# Altium schematic sheet 电源管理板Qiao.SchDoc
size A3
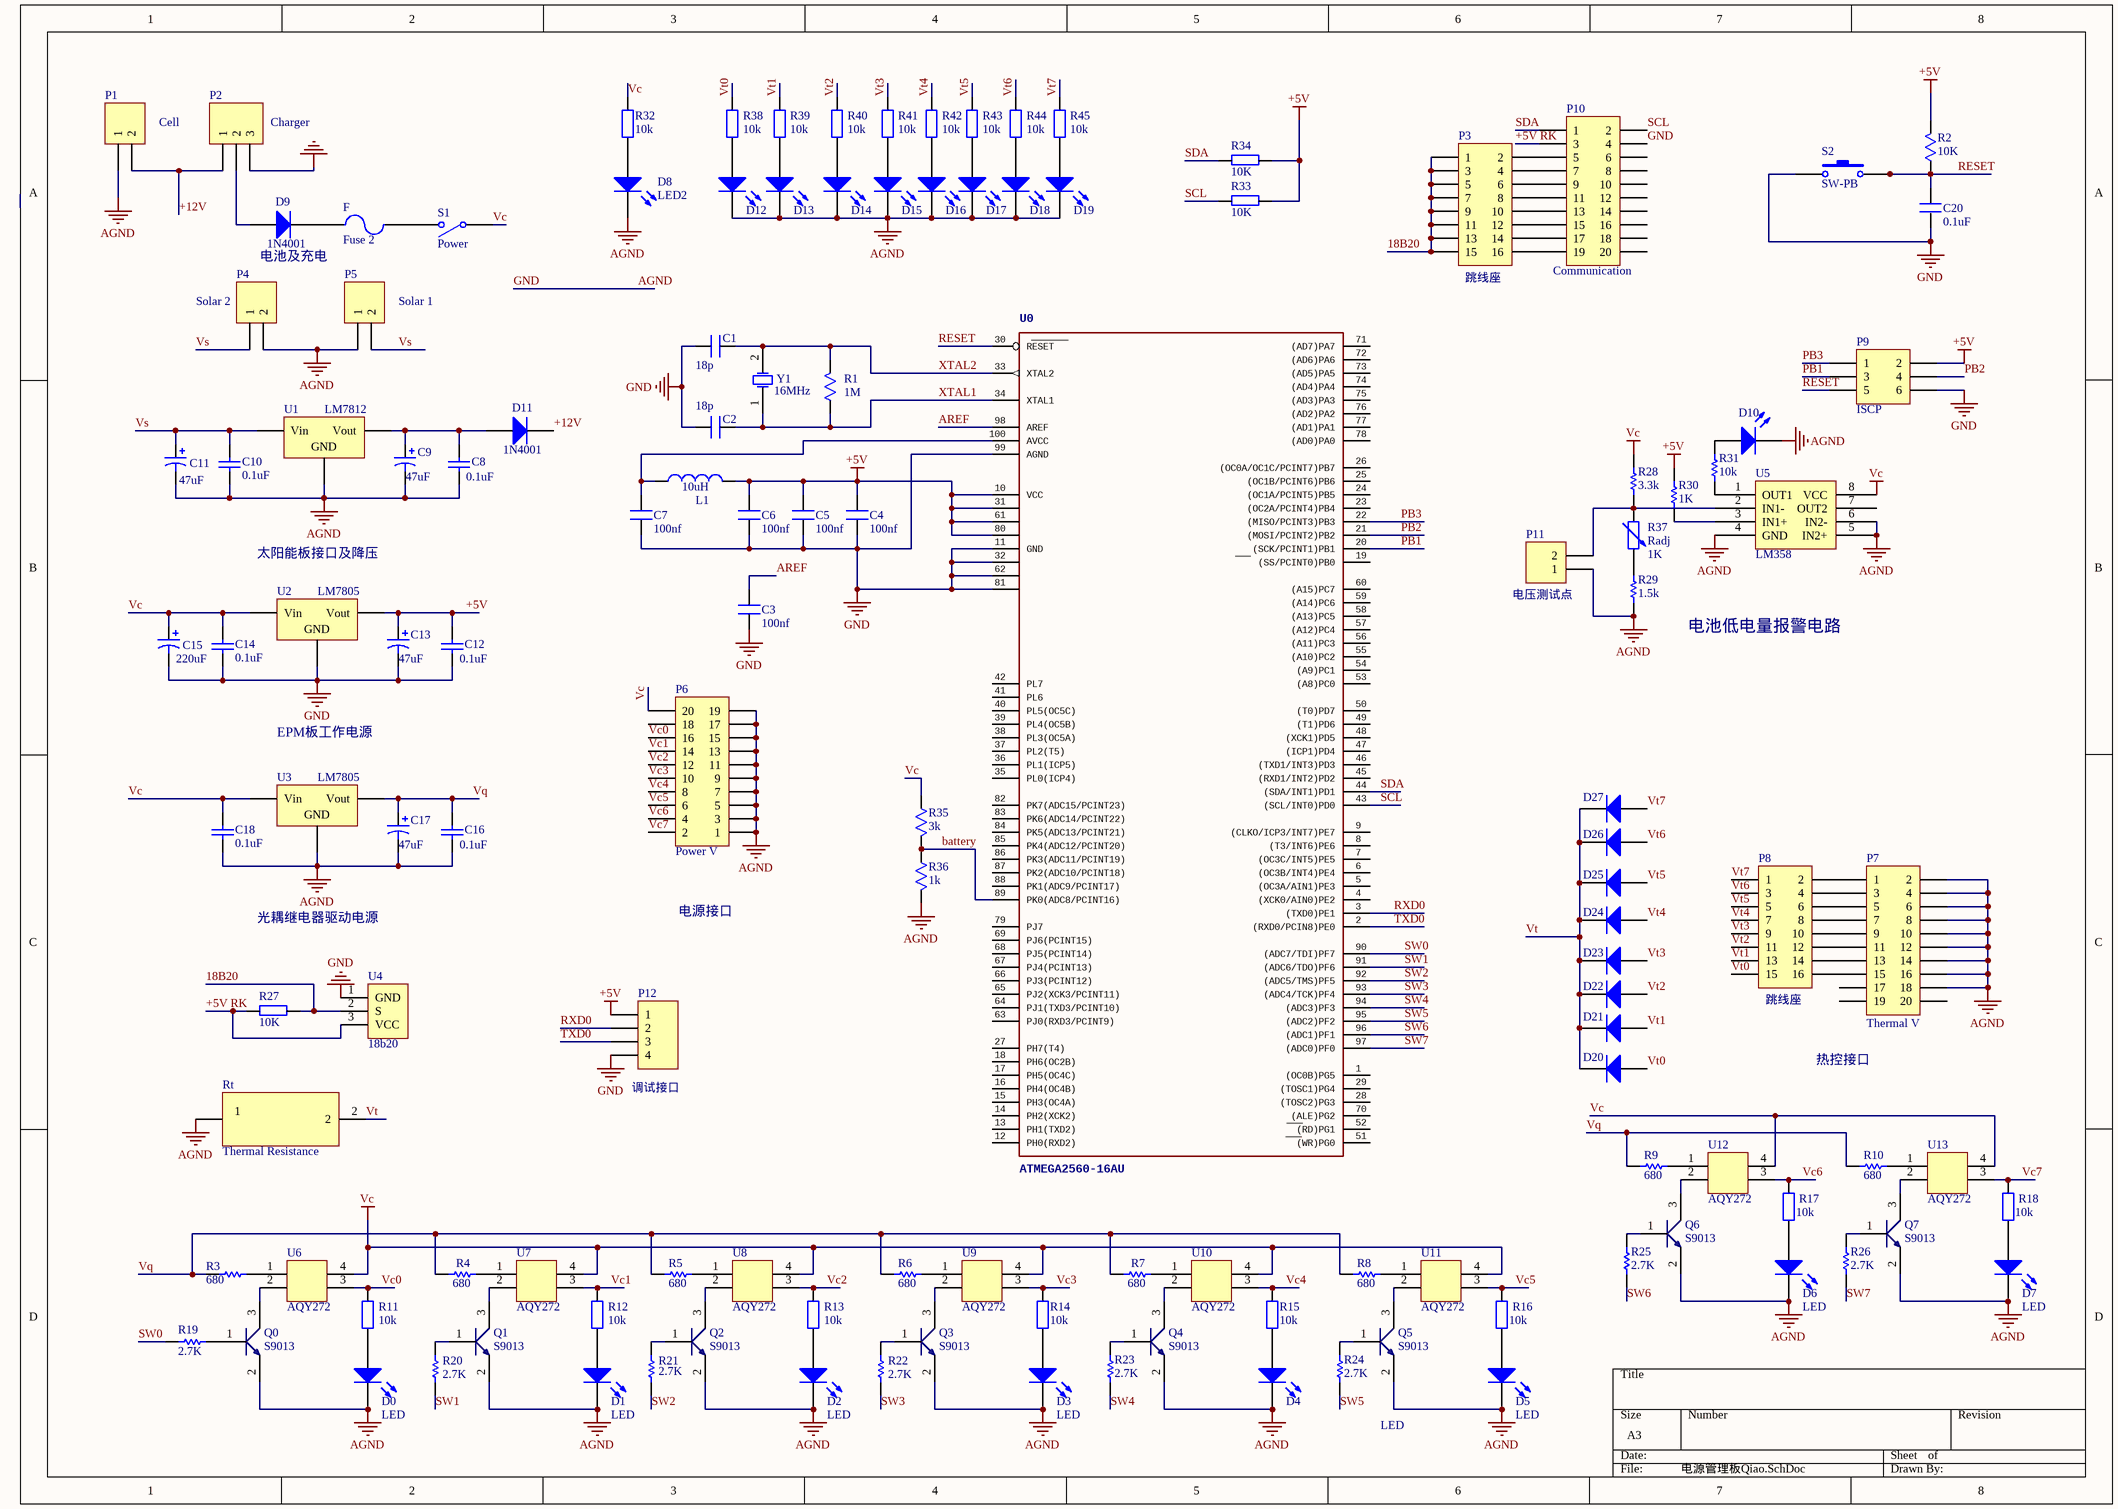
[diagram p0: 电源管理板Qiao.SchDoc]

## Parts
C1  18p  [CAPC3216M]
C2  18p  [CAPC3216M]
C3  100nf  [CAPC3216M]
C4  100nf  [CAPC3216M]
C5  100nf  [CAPC3216M]
C6  100nf  [CAPC3216M]
C7  100nf  [CAPC3216M]
C8  0.1uf  [CAPC3216M]
C9  value 47uF  [25V47uF]  (hidden comment: 25V47uF)
C10  0.1uf  [CAPC3216M]
C11  value 47uF  [25V47uF]  (hidden comment: 25V47uF)
C12  0.1uf  [CAPC3216M]
C13  value 47uF  [25V47uF]  (hidden comment: 25V47uF)
C14  0.1uf  [CAPC3216M]
C15  value 220uF  [25V47uF]  (hidden comment: 50V220uF)
C16  0.1uf  [CAPC3216M]
C17  value 47uF  [25V47uF]  (hidden comment: 25V47uF)
C18  0.1uf  [CAPC3216M]
C20  0.1uF  [CAPC3216M]
D0  LED  [LED]
D1  LED  [LED]
D2  LED  [LED]
D3  LED  [LED]
D4  LED  [LED]
D5  LED  [LED]
D6  LED  [LED]
D7  LED  [LED]
D8  LED2  [DIPLED]
D9  1N4001  [SMB]
D10  LED  [DIPLED]  (value not drawn)
D11  1N4001  [SMB]
D12  LED  [LED]  (value not drawn)
D13  LED  [LED]  (value not drawn)
D14  LED  [LED]  (value not drawn)
D15  LED  [LED]  (value not drawn)
D16  LED  [LED]  (value not drawn)
D17  LED  [LED]  (value not drawn)
D18  LED  [LED]  (value not drawn)
D19  LED  [LED]  (value not drawn)
D20  1N4001  [SMB]  (value not drawn)
D21  1N4001  [SMB]  (value not drawn)
D22  1N4001  [SMB]  (value not drawn)
D23  1N4001  [SMB]  (value not drawn)
D24  1N4001  [SMB]  (value not drawn)
D25  1N4001  [SMB]  (value not drawn)
D26  1N4001  [SMB]  (value not drawn)
D27  1N4001  [SMB]  (value not drawn)
F  Fuse 2  [1812]
L1  value 10uH  [CAPC3216M]  (hidden comment: Inductor)
P1  Cell  [2P3.96wanzhenzuo]
P2  Charger  [ChargeSocket]
P3  跳线座  [HDR2X8]
P4  Solar 2  [2P3.96wanzhenzuo]
P5  Solar 1  [2P3.96wanzhenzuo]
P6  Power V  [HDR2X10]
P7  Thermal V  [HDR2X10]
P8  跳线座  [HDR2X8]
P9  ISCP  [HDR2X3]
P10  Communication  [HDR2X10]
P11  电压测试点  [HDR1X2]
P12  调试接口  [HDR1X4]
Q0  S9013  [SOT23]
Q1  S9013  [sot23]
Q2  S9013  [sot23]
Q3  S9013  [sot23]
Q4  S9013  [sot23]
Q5  S9013  [sot23]
Q6  S9013  [sot23]
Q7  S9013  [sot23]
R1  1M  [RESC3216M]
R2  10K  [RESC3216M]
R3  680  [RESC3216M]
R4  680  [RESC3216M]
R5  680  [RESC3216M]
R6  680  [RESC3216M]
R7  680  [RESC3216M]
R8  680  [RESC3216M]
R9  680  [RESC3216M]
R10  680  [RESC3216M]
R11  10K  [RESC3216M]
R12  10K  [RESC3216M]
R13  10K  [RESC3216M]
R14  10K  [RESC3216M]
R15  10K  [RESC3216M]
R16  10K  [RESC3216M]
R17  10K  [RESC3216M]
R18  10K  [RESC3216M]
R19  2.7K  [RESC3216M]
R20  2.7K  [RESC3216M]
R21  2.7K  [RESC3216M]
R22  2.7K  [RESC3216M]
R23  2.7K  [RESC3216M]
R24  2.7K  [RESC3216M]
R25  2.7K  [RESC3216M]
R26  2.7K  [RESC3216M]
R27  10K  [RESC3216M]
R28  3.3k  [CAPC3216M]
R29  1.5k  [CAPC3216M]
R30  1K  [CAPC3216M]
R31  10k  [CAPC3216M]
R32  10k  [RESC3216M]
R33  10K  [RESC3216M]
R34  10K  [RESC3216M]
R35  3k  [RESC3216M]
R36  1k  [RESC3216M]
R37  Radj  value 1K  [ResAdj]
R38  10K  [RESC3216M]
R39  10K  [RESC3216M]
R40  10K  [RESC3216M]
R41  10K  [RESC3216M]
R42  10K  [RESC3216M]
R43  10K  [RESC3216M]
R44  10K  [RESC3216M]
R45  10K  [RESC3216M]
Rt  Thermal Resistance  [Thermal Res]
S1  Power  [PWRSWITCH]
S2  SW-PB  [PUSH BUTTON 6x6]
U0  ATMEGA2560-16AU  [TQFP100]
U1  LM7812  [DPAK-3]
U2  LM7805  [DPAK-3]
U3  LM7805  [DPAK-3]
U4  18b20  [TO92]
U5  LM358  [SO-8]
U6  AQY272  [AQY272]
U7  AQY272  [AQY272]
U8  AQY272  [AQY272]
U9  AQY272  [AQY272]
U10  AQY272  [AQY272]
U11  AQY272  [AQY272]
U12  AQY272  [AQY272]
U13  AQY272  [AQY272]
Y1  16MHz  [XTAL_US]

## Nets
+5V: C4.2 C5.2 C6.2 C12.2 C13.1 L1.2 P9.2 P12.1 R2.2 R30.2 R33.1 R34.1 U0.10(VCC) U0.31(VCC1) U0.61(VCC2) U0.80(VCC3) U2.3(Vout)
AGND: C1.1 C2.1 C3.1 C4.1 C5.1 C6.1 C7.1 C8.1 C9.2 C10.1 C11.2 C12.1 C13.2 C14.1 C15.2 C16.1 C17.2 C18.1 C20.1 D0.2(K) D1.2(K) D2.2(K) D3.2(K) D4.2(K) D5.2(K) D6.2(K) D7.2(K) D8.2(K) D10.2(K) D12.2(K) D13.2(K) D14.2(K) D15.2(K) D16.2(K) D17.2(K) D18.2(K) D19.2(K) P1.1 P2.3 P4.2 P5.1 P6.1 P6.3 P6.5 P6.7 P6.9 P6.11 P6.13 P6.15 P6.17 P6.19 P7.2 P7.4 P7.6 P7.8 P7.10 P7.12 P7.14 P7.16 P7.18 P9.6 P10.4 P11.1 P12.4 Q0.2 Q1.2 Q2.2 Q3.2 Q4.2 Q5.2 Q6.2 Q7.2 R29.1 R36.2 Rt.1 S2.1 U0.11(GND) U0.32(GND1) U0.62(GND2) U0.81(GND3) U0.99(AGND) U1.2(GND) U2.2(GND) U3.2(GND) U4.1(GND) U5.4(GND) U5.5(IN2+) U5.6(IN2-)  [also labelled GND]
Vc: C14.2 C15.1 C18.2 P6.20 R28.1 R32.2 R35.1 S1.1(COMMON) U2.1(Vin) U3.1(Vin) U5.8(VCC) U6.4 U7.4 U8.4 U9.4 U10.4 U11.4 U12.4 U13.4
18B20: P3.1 P3.3 P3.5 P3.7 P3.9 P3.11 P3.13 P3.15 R27.1 U4.2(S)
+5V RK: P10.3 R27.2 U4.3(VCC)
+12V: D11.2(K) P1.2 P2.1
AREF: C3.2 U0.98(AREF)
battery: R35.2 R36.1 U0.89(PK0(ADC8/PCINT16))
PB1: P9.3 U0.20((SCK/PCINT1)PB1)
PB2: P9.4 U0.21((MOSI/PCINT2)PB2)
PB3: P9.1 U0.22((MISO/PCINT3)PB3)
RESET: C20.2 P9.5 R2.1 S2.2 U0.30(RESET)
RXD0: P12.2 U0.3((TXD0)PE1)
SCL: P10.2 R33.2 U0.43((SCL/INT0)PD0)
SDA: P10.1 R34.2 U0.44((SDA/INT1)PD1)
SW0: R19.1 U0.90((ADC7/TDI)PF7)
SW1: R20.1 U0.91((ADC6/TDO)PF6)
SW2: R21.1 U0.92((ADC5/TMS)PF5)
SW3: R22.1 U0.93((ADC4/TCK)PF4)
SW4: R23.1 U0.94((ADC3)PF3)
SW5: R24.1 U0.95((ADC2)PF2)
SW6: R25.1 U0.96((ADC1)PF1)
SW7: R26.1 U0.97((ADC0)PF0)
TXD0: P12.3 U0.2((RXD0/PCIN8)PE0)
Vc0: P6.16 R11.2 U6.3
Vc1: P6.14 R12.2 U7.3
Vc2: P6.12 R13.2 U8.3
Vc3: P6.10 R14.2 U9.3
Vc4: P6.8 R15.2 U10.3
Vc5: P6.6 R16.2 U11.3
Vc6: P6.4 R17.2 U12.3
Vc7: P6.2 R18.2 U13.3
Vq: C16.2 C17.1 R3.1 R4.1 R5.1 R6.1 R7.1 R8.1 R9.1 R10.1 U3.3(Vout)
Vs: C10.2 C11.1 P4.1 P5.2 U1.1(Vin)
Vt: D20.2(K) D21.2(K) D22.2(K) D23.2(K) D24.2(K) D25.2(K) D26.2(K) D27.2(K) Rt.2
Vt0: D20.1(A) P8.15 R38.2
Vt1: D21.1(A) P8.13 R39.2
Vt2: D22.1(A) P8.11 R40.2
Vt3: D23.1(A) P8.9 R41.2
Vt4: D24.1(A) P8.7 R42.2
Vt5: D25.1(A) P8.5 R43.2
Vt6: D26.1(A) P8.3 R44.2
Vt7: D27.1(A) P8.1 R45.2
XTAL1: C2.2 R1.1 U0.34(XTAL1) Y1.1(OSC1)
XTAL2: C1.2 R1.2 U0.33(XTAL2) Y1.2(OSC2)
NetC7_2: C7.2 L1.1 U0.100(AVCC)
NetC8_2: C8.2 C9.1 D11.1(A) U1.3(Vout)
NetD0_1: D0.1(A) R11.1
NetD1_1: D1.1(A) R12.1
NetD2_1: D2.1(A) R13.1
NetD3_1: D3.1(A) R14.1
NetD4_1: D4.1(A) R15.1
NetD5_1: D5.1(A) R16.1
NetD6_1: D6.1(A) R17.1
NetD7_1: D7.1(A) R18.1
NetD8_1: D8.1(A) R32.1
NetD9_1: D9.1(A) P2.2
NetD9_2: D9.2(K) F.1
NetD10_1: D10.1(A) R31.2
NetD12_1: D12.1(A) R38.1
NetD13_1: D13.1(A) R39.1
NetD14_1: D14.1(A) R40.1
NetD15_1: D15.1(A) R41.1
NetD16_1: D16.1(A) R42.1
NetD17_1: D17.1(A) R43.1
NetD18_1: D18.1(A) R44.1
NetD19_1: D19.1(A) R45.1
NetF_2: F.2 S1.2(NO)
NetP3_2: P3.2 P10.5
NetP3_4: P3.4 P10.7
NetP3_6: P3.6 P10.9
NetP3_8: P3.8 P10.11
NetP3_10: P3.10 P10.13
NetP3_12: P3.12 P10.15
NetP3_14: P3.14 P10.17
NetP3_16: P3.16 P10.19
NetP7_1: P7.1 P8.2
NetP7_3: P7.3 P8.4
NetP7_5: P7.5 P8.6
NetP7_7: P7.7 P8.8
NetP7_9: P7.9 P8.10
NetP7_11: P7.11 P8.12
NetP7_13: P7.13 P8.14
NetP7_15: P7.15 P8.16
NetP11_2: P11.2 R28.2 R37.1 U5.2(IN1-)
NetQ0_1: Q0.1 R19.2
NetQ0_3: Q0.3 U6.2
NetQ1_1: Q1.1 R20.2
NetQ1_3: Q1.3 U7.2
NetQ2_1: Q2.1 R21.2
NetQ2_3: Q2.3 U8.2
NetQ3_1: Q3.1 R22.2
NetQ3_3: Q3.3 U9.2
NetQ4_1: Q4.1 R23.2
NetQ4_3: Q4.3 U10.2
NetQ5_1: Q5.1 R24.2
NetQ5_3: Q5.3 U11.2
NetQ6_1: Q6.1 R25.2
NetQ6_3: Q6.3 U12.2
NetQ7_1: Q7.1 R26.2
NetQ7_3: Q7.3 U13.2
NetR3_2: R3.2 U6.1
NetR4_2: R4.2 U7.1
NetR5_2: R5.2 U8.1
NetR6_2: R6.2 U9.1
NetR7_2: R7.2 U10.1
NetR8_2: R8.2 U11.1
NetR9_2: R9.2 U12.1
NetR10_2: R10.2 U13.1
NetR29_2: R29.2 R37.2
NetR30_1: R30.1 U5.3(IN1+)
NetR31_1: R31.1 U5.1(OUT1)

Not connected (* = marked no-connect by the designer): P6 18; P7 17 19 20; P10 6 8 10 12 14 16 18 20; U0 1((OC0B)PG5) 4((XCK0/AIN0)PE2) 5((OC3A/AIN1)PE3) 6((OC3B/INT4)PE4) 7((OC3C/INT5)PE5) 8((T3/INT6)PE6) 9((CLKO/ICP3/INT7)PE7) 12(PH0(RXD2)) 13(PH1(TXD2)) 14(PH2(XCK2)) 15(PH3(OC4A)) 16(PH4(OC4B)) 17(PH5(OC4C)) 18(PH6(OC2B)) 19((SS/PCINT0)PB0) 23((OC2A/PCINT4)PB4) 24((OC1A/PCINT5)PB5) 25((OC1B/PCINT6)PB6) 26((OC0A/OC1C/PCINT7)PB7) 27(PH7(T4)) 28((TOSC2)PG3) 29((TOSC1)PG4) 35(PL0(ICP4)) 36(PL1(ICP5)) 37(PL2(T5)) 38(PL3(OC5A)) 39(PL4(OC5B)) 40(PL5(OC5C)) 41(PL6) 42(PL7) 45((RXD1/INT2)PD2) 46((TXD1/INT3)PD3) 47((ICP1)PD4) 48((XCK1)PD5) 49((T1)PD6) 50((T0)PD7) 51((WR)PG0) 52((RD)PG1) 53((A8)PC0) 54((A9)PC1) 55((A10)PC2) 56((A11)PC3) 57((A12)PC4) 58((A13)PC5) 59((A14)PC6) 60((A15)PC7) 63(PJ0(RXD3/PCINT9)) 64(PJ1(TXD3/PCINT10)) 65(PJ2(XCK3/PCINT11)) 66(PJ3(PCINT12)) 67(PJ4(PCINT13)) 68(PJ5(PCINT14)) 69(PJ6(PCINT15)) 70((ALE)PG2) 71((AD7)PA7) 72((AD6)PA6) 73((AD5)PA5) 74((AD4)PA4) 75((AD3)PA3) 76((AD2)PA2) 77((AD1)PA1) 78((AD0)PA0) 79(PJ7) 82(PK7(ADC15/PCINT23)) 83(PK6(ADC14/PCINT22)) 84(PK5(ADC13/PCINT21)) 85(PK4(ADC12/PCINT20)) 86(PK3(ADC11/PCINT19)) 87(PK2(ADC10/PCINT18)) 88(PK1(ADC9/PCINT17)); U5 7(OUT2)

## Notes on the sheet
- (near D9) 电池及充电
- (near U2) 太阳能板接口及降压
- 电池低电量报警电路
- EPM板工作电源
- 光耦继电器驱动电源
- 电源接口
- 热控接口

## Library data of the parts
C1 C2 = C_1
C3-C7 = C
C8 C12 C16 = Cap Semi: Published: 8-Jun-2000; LatestRevisionDate: 17-Jul-2002; LatestRevisionNote: Re-released for DXP Platform.; PackageReference: C1206; Publisher: Altium Limited; Value: 0.1uF
C9 C11 = Cap Pol3: 47uf; Published: 8-Jun-2000; LatestRevisionDate: 17-Jul-2002; LatestRevisionNote: Re-released for DXP Platform.; PackageReference: C0805; Publisher: Altium Limited
C10 C14 C18 = Cap: Published: 8-Jun-2000; LatestRevisionDate: 17-Jul-2002; LatestRevisionNote: Re-released for DXP Platform.; Publisher: Altium Limited; Value: 0.1uF
C13 C15 C17 = Cap Pol3: 10uf; Published: 8-Jun-2000; LatestRevisionDate: 17-Jul-2002; LatestRevisionNote: Re-released for DXP Platform.; PackageReference: C0805; Publisher: Altium Limited
C20 = C_3
D0-D8 D12-D19 = LED2: Typical RED, GREEN, YELLOW, AMBER GaAs LED; Published: 8-Jun-2000; LatestRevisionDate: 17-Jul-2002; LatestRevisionNote: Re-released for DXP Platform.; PackageDocument: Feb-2002; PackageReference: 3.2X1.6X1.1; Publisher: Altium Limited
D9 D11 D20-D27 = Diode 1N4001: 1 Amp General Purpose Rectifier; Published: 8-Jun-2000; LatestRevisionDate: 17-Jul-2002; LatestRevisionNote: Re-released for DXP Platform.; DatasheetVersion: 1998; PackageVersion: Aug-1999; PackageReference: DO-41; Publisher: Altium Limited; PackageDescription: Diode, Axial; Body 5.2 x 2.7 mm (LxDia. max), Lead Dia. 0.86 mm (max); Code_JEDEC: DO-204-AL; ComponentLink1Description: Manufacturer Link; ComponentLink1URL: http://www.fairchildsemi.com/; ComponentLink2Description: Datasheet; ComponentLink2URL: http://www.fairchildsemi.com/ds/1N%2F1N4001.pdf
F = Fuse 2: Fuse; Published: 8-Jun-2000; LatestRevisionDate: 17-Jul-2002; LatestRevisionNote: Re-released for DXP Platform.; PackageReference: PIN-W2/E2.8; Publisher: Altium Limited; PackageDescription: Thru-Hole; 2 Leads
L1 = Inductor: Code_IEC: 1005; Published: 8-Jun-2000; LatestRevisionDate: 29-May-2009; LatestRevisionNote: IPC-7351 Footprint Added.; PackageReference: 0402-A; Publisher: Altium Limited; PackageDescription: Chip Inductor; Code_JEITA: 0402
P1 P4 P5 P11 = Header 2: Header, 2-Pin; LatestRevisionDate: 17-Jul-2002; LatestRevisionNote: Re-released for DXP Platform.; Publisher: Altium Limited
P2 = Header 3: Header, 3-Pin; LatestRevisionDate: 17-Jul-2002; LatestRevisionNote: Re-released for DXP Platform.; Publisher: Altium Limited
P3 P8 = Header 8X2: Header, 8-Pin, Dual row; LatestRevisionDate: 17-Jul-2002; LatestRevisionNote: Re-released for DXP Platform.; Publisher: Altium Limited
P6 P7 P10 = Header 10X2: Header, 10-Pin, Dual row; LatestRevisionDate: 17-Jul-2002; LatestRevisionNote: Re-released for DXP Platform.; Publisher: Altium Limited
P9 = Header 3X2: Header, 3-Pin, Dual row; LatestRevisionDate: 17-Jul-2002; LatestRevisionNote: Re-released for DXP Platform.; Publisher: Altium Limited
P12 = Header 4: Header, 4-Pin; LatestRevisionDate: 17-Jul-2002; LatestRevisionNote: Re-released for DXP Platform.; Publisher: Altium Limited
R1 R2 R35 R36 = RES
R3-R10 R19-R26 R28-R31 = Res: resistance
R11-R18 R32 R38-R45 = Res2: 5.1k; Published: 8-Jun-2000; LatestRevisionDate: 17-Jul-2002; LatestRevisionNote: Re-released for DXP Platform.; PackageReference: AXIAL-0.4; Publisher: Altium Limited; Value: 10k
R27 R33 R34 = R
R37 = Res Adj2: Variable Resistor; Set Position: 0.5; Published: 8-Jun-2000; LatestRevisionDate: 17-Jul-2002; LatestRevisionNote: Re-released for DXP Platform.; PackageReference: AXIAL-0.6; Publisher: Altium Limited; PackageDescription: Axial Device, Thru-Hole; 2 Leads; 0.6 in Pin Spacing
Rt = ThermalResistance
S1 = SW-SPST: Single-Pole, Single-Throw Switch; Published: 24-Mar-1999; LatestRevisionDate: 17-Jul-2002; LatestRevisionNote: Re-released for DXP Platform.; PackageReference: SPST-2; Publisher: Altium Limited; PackageDescription: Switch; 2 Leads
S2 = SW-PB: Switch; Published: 24-Mar-1999; LatestRevisionDate: 17-Jul-2002; LatestRevisionNote: Re-released for DXP Platform.; PackageReference: SPST-2; Publisher: Altium Limited; PackageDescription: Switch; 2 Leads
U0 = ATMEGA2560AU: <b>MICROCONTROLLER</b><p> / 64/128/256 Kbytes FLASH<p> / 4 Kbytes EEPROM<p> / 8 Kbytes SRAM<p> / 86 General Purpose I/O pins<p> / 12-channels16-bit PWM<p> / 4 x Serial USARTs<p> / 16-channels 10-bit A/D<p>
U1-U3 = Volt Reg: Voltage Regulator; Published: 24-Mar-1999; LatestRevisionDate: 29-May-2009; LatestRevisionNote: IPC-7351 Footprint Added.; PackageReference: D2PAK; Publisher: Altium Limited; PackageDescription: 3-Pin Transistor Outline Package 2.54 mm Pitch, 15.1 mm Lead Span
Y1 = XTAL: Crystal Oscillator; Published: 8-Jun-2000; LatestRevisionDate: 17-Jul-2002; LatestRevisionNote: Re-released for DXP Platform.; Publisher: Altium Limited